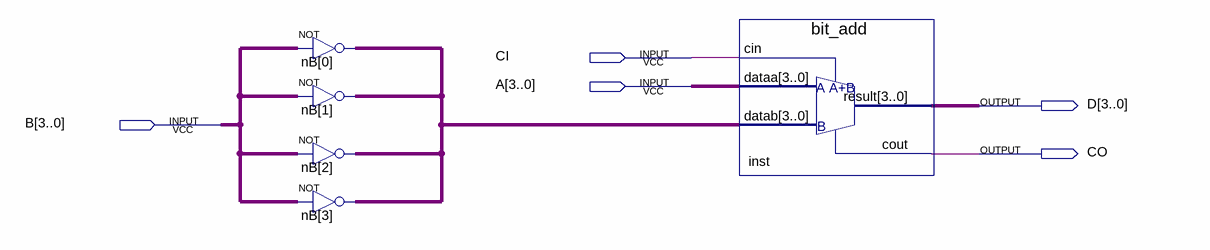
[diagram p0: schematic sheet]
// Quartus schematic sub_4.bdf as structural Verilog: 5 symbols, 5 pins
module sub_4 (
  input  CI,
  input  [3:0] A,
  input  [3:0] B,
  output [3:0] D,
  output CO
);

  wire [3:0] nB_0__out;

  assign nB_0__out = ~B;  // NOT nB[0], 4 bits wide
  assign nB_0__out = ~B;  // NOT nB[1], 4 bits wide
  assign nB_0__out = ~B;  // NOT nB[2], 4 bits wide
  assign nB_0__out = ~B;  // NOT nB[3], 4 bits wide
  bit_add inst (.cin(CI), .dataa(A), .datab(nB_0__out), .result(D), .cout(CO));
endmodule
